# Altium schematic sheet TipWiring.SchDoc
size A
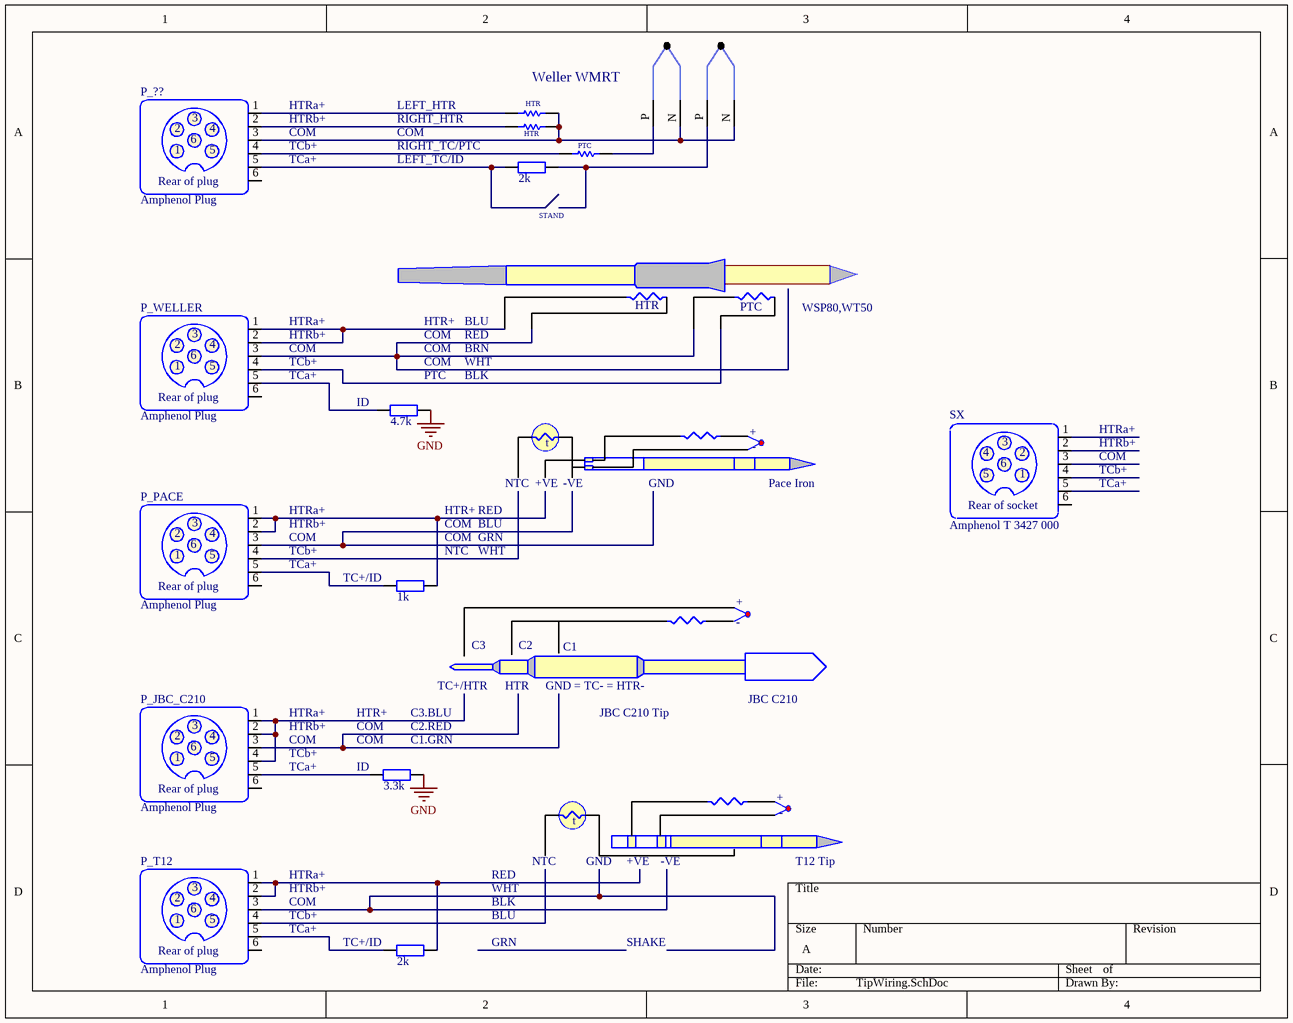
[diagram p0: TipWiring.SchDoc]

## Parts
(Parts that share a designator on the sheet are numbered #1, #2 ... from top to bottom, then left to right.)
JBC_C210_Tip  JBC C210  (mechanical)
P_??  Amphenol Plug  (mechanical)
P_JBC_C210  Amphenol Plug  (mechanical)
P_PACE  Amphenol Plug  (mechanical)
P_T12  Amphenol Plug  (mechanical)
P_WELLER  Amphenol Plug  (mechanical)
Pace_Iron  Pace  (value not drawn)  (mechanical)
R?#1  Resistor  (value not drawn)
R?#2  Resistor  (value not drawn)
R?#3  Resistor  (value not drawn)
R?#4  2k  [CR2012-0805]
R?#5  4.7k  [CR2012-0805]
R?#6  1k  [CR2012-0805]
R?#7  3.3k  [CR2012-0805]
R?#8  2k  [CR2012-0805]
SX  Amphenol T 3427 000  (mechanical)
T12_Tip  T12 Tip  (value not drawn)  (mechanical)
T?#1  Thermocouple  [ThermoCoupleSocket]  (value not drawn)
T?#2  Thermocouple  [ThermoCoupleSocket]  (value not drawn)
WSP80,WT50  WELLER WSP80  (value not drawn)  (mechanical)

## Nets
GND: R?#5.1 R?#7.1
NetP_??_1: P_??.1 R?#1.1
NetP_??_2: P_??.2 R?#2.1
NetP_??_3: P_??.3 R?#1.2 R?#2.2 T?#1.N T?#2.N
NetP_??_4: P_??.4 R?#3.1
NetP_??_5: P_??.5 R?#4.2
NetP_JBC_C210_1: P_JBC_C210.1 P_JBC_C210.2 P_JBC_C210.4
NetP_JBC_C210_5: P_JBC_C210.5 R?#7.2
NetP_PACE_1: P_PACE.1 P_PACE.2 R?#6.1
NetP_PACE_5: P_PACE.5 R?#6.2
NetP_T12_1: P_T12.1 P_T12.2 R?#8.1
NetP_T12_5: P_T12.5 R?#8.2
NetP_WELLER_1: P_WELLER.1 P_WELLER.2
NetP_WELLER_5: P_WELLER.5 R?#5.2
NetR?#3_2: R?#3.2 T?#1.P
NetR?#4_1: R?#4.1 T?#2.P

Not connected (* = marked no-connect by the designer): P_?? 6; P_JBC_C210 3 6; P_PACE 3 4 6; P_T12 3 4 6; P_WELLER 3 4 6; SX 1 2 3 4 5 6

## Notes on the sheet
- (near R?#1) Weller WMRT
- (near P_??) HTRb+
- (near P_??) HTRa+
- (near P_??) TCa+
- (near P_??) COM
- (near P_??) TCb+
- COM
- LEFT_HTR
- RIGHT_HTR
- LEFT_TC/ID
- (near R?#2) RIGHT_TC/PTC
- (near R?#2) HTR
- (near R?#1) HTR
- (near R?#3) PTC
- (near R?#4) STAND
- (near P_WELLER) HTRb+
- (near P_WELLER) HTRa+
- (near P_WELLER) COM
- (near P_WELLER) TCb+
- HTR+
- (near R?#5) COM
- RED
- WHT
- BLU
- BRN
- (near P_WELLER) TCa+
- (near R?#5) ID
- (near R?#5) PTC
- BLK
- (near SX) HTRa+
- (near SX) HTRb+
- (near SX) TCa+
- (near SX) COM
- (near SX) TCb+
- (near P_PACE) HTRb+
- (near P_PACE) HTRa+
- (near P_PACE) TCa+
- (near P_PACE) COM
- (near P_PACE) TCb+
- (near R?#6) COM
- (near R?#6) NTC
- GRN
- (near R?#6) TC+/ID
- (near P_JBC_C210) HTRb+
- (near P_JBC_C210) HTRa+
- (near P_JBC_C210) TCa+
- (near P_JBC_C210) COM
- (near P_JBC_C210) TCb+
- (near R?#7) ID
- (near R?#7) COM
- (near R?#7) C2.RED
- (near R?#7) C1.GRN
- C3.BLU
- (near P_T12) HTRb+
- (near P_T12) HTRa+
- (near P_T12) COM
- (near P_T12) TCa+
- (near P_T12) TCb+
- (near R?#8) TC+/ID
- SHAKE
- (in symbol Amphenol Plug) Rear of plug
- (in symbol Amphenol T 3427 000) Rear of socket
- (in symbol JBC C210) +; -; C3; C2; C1; TC+/HTR; HTR; GND = TC- = HTR-
- (in symbol Pace) +; t; -; NTC; +VE; -VE; GND
- (in symbol T12 Tip) +; -; t; NTC; GND; +VE; -VE
- (in symbol WELLER WSP80) HTR; PTC

## Library data of the parts
P_?? P_JBC_C210 P_PACE P_T12 P_WELLER = Amphenol Plug: Circular Connector, C091B Series, Panel Mount Receptacle, 6 Contacts, Solder Socket, Metal Body
R?#1-R?#3 = Resistor: TC1: 0; SimulationGenericComponent: True; Value: 1K; TC2: 0
R?#4-R?#8 = Res_CR0805: Resistor SMT 0805; Manufacturer: Generic Components; Class: Passive; Published: 08/06/2000; Publisher: Altium Hobart Technology Centre; SubClass: Resistor; Farnell PN: *; Digikey: *; LCSC: *
  R?#4 R?#8: Value: 2k
  R?#5: Value: 4.7k
  R?#6: Value: 1k
  R?#7: Value: 3.3k
SX = Amphenol T 3427 000: Circular Connector, C091B Series, Panel Mount Receptacle, 6 Contacts, Solder Socket, Metal Body
T?#1 T?#2 = Thermocouple: LCSC: *